# Altium schematic sheet GEN.SchDoc
size A3; SheetNumber: 1; SheetTotal: 3
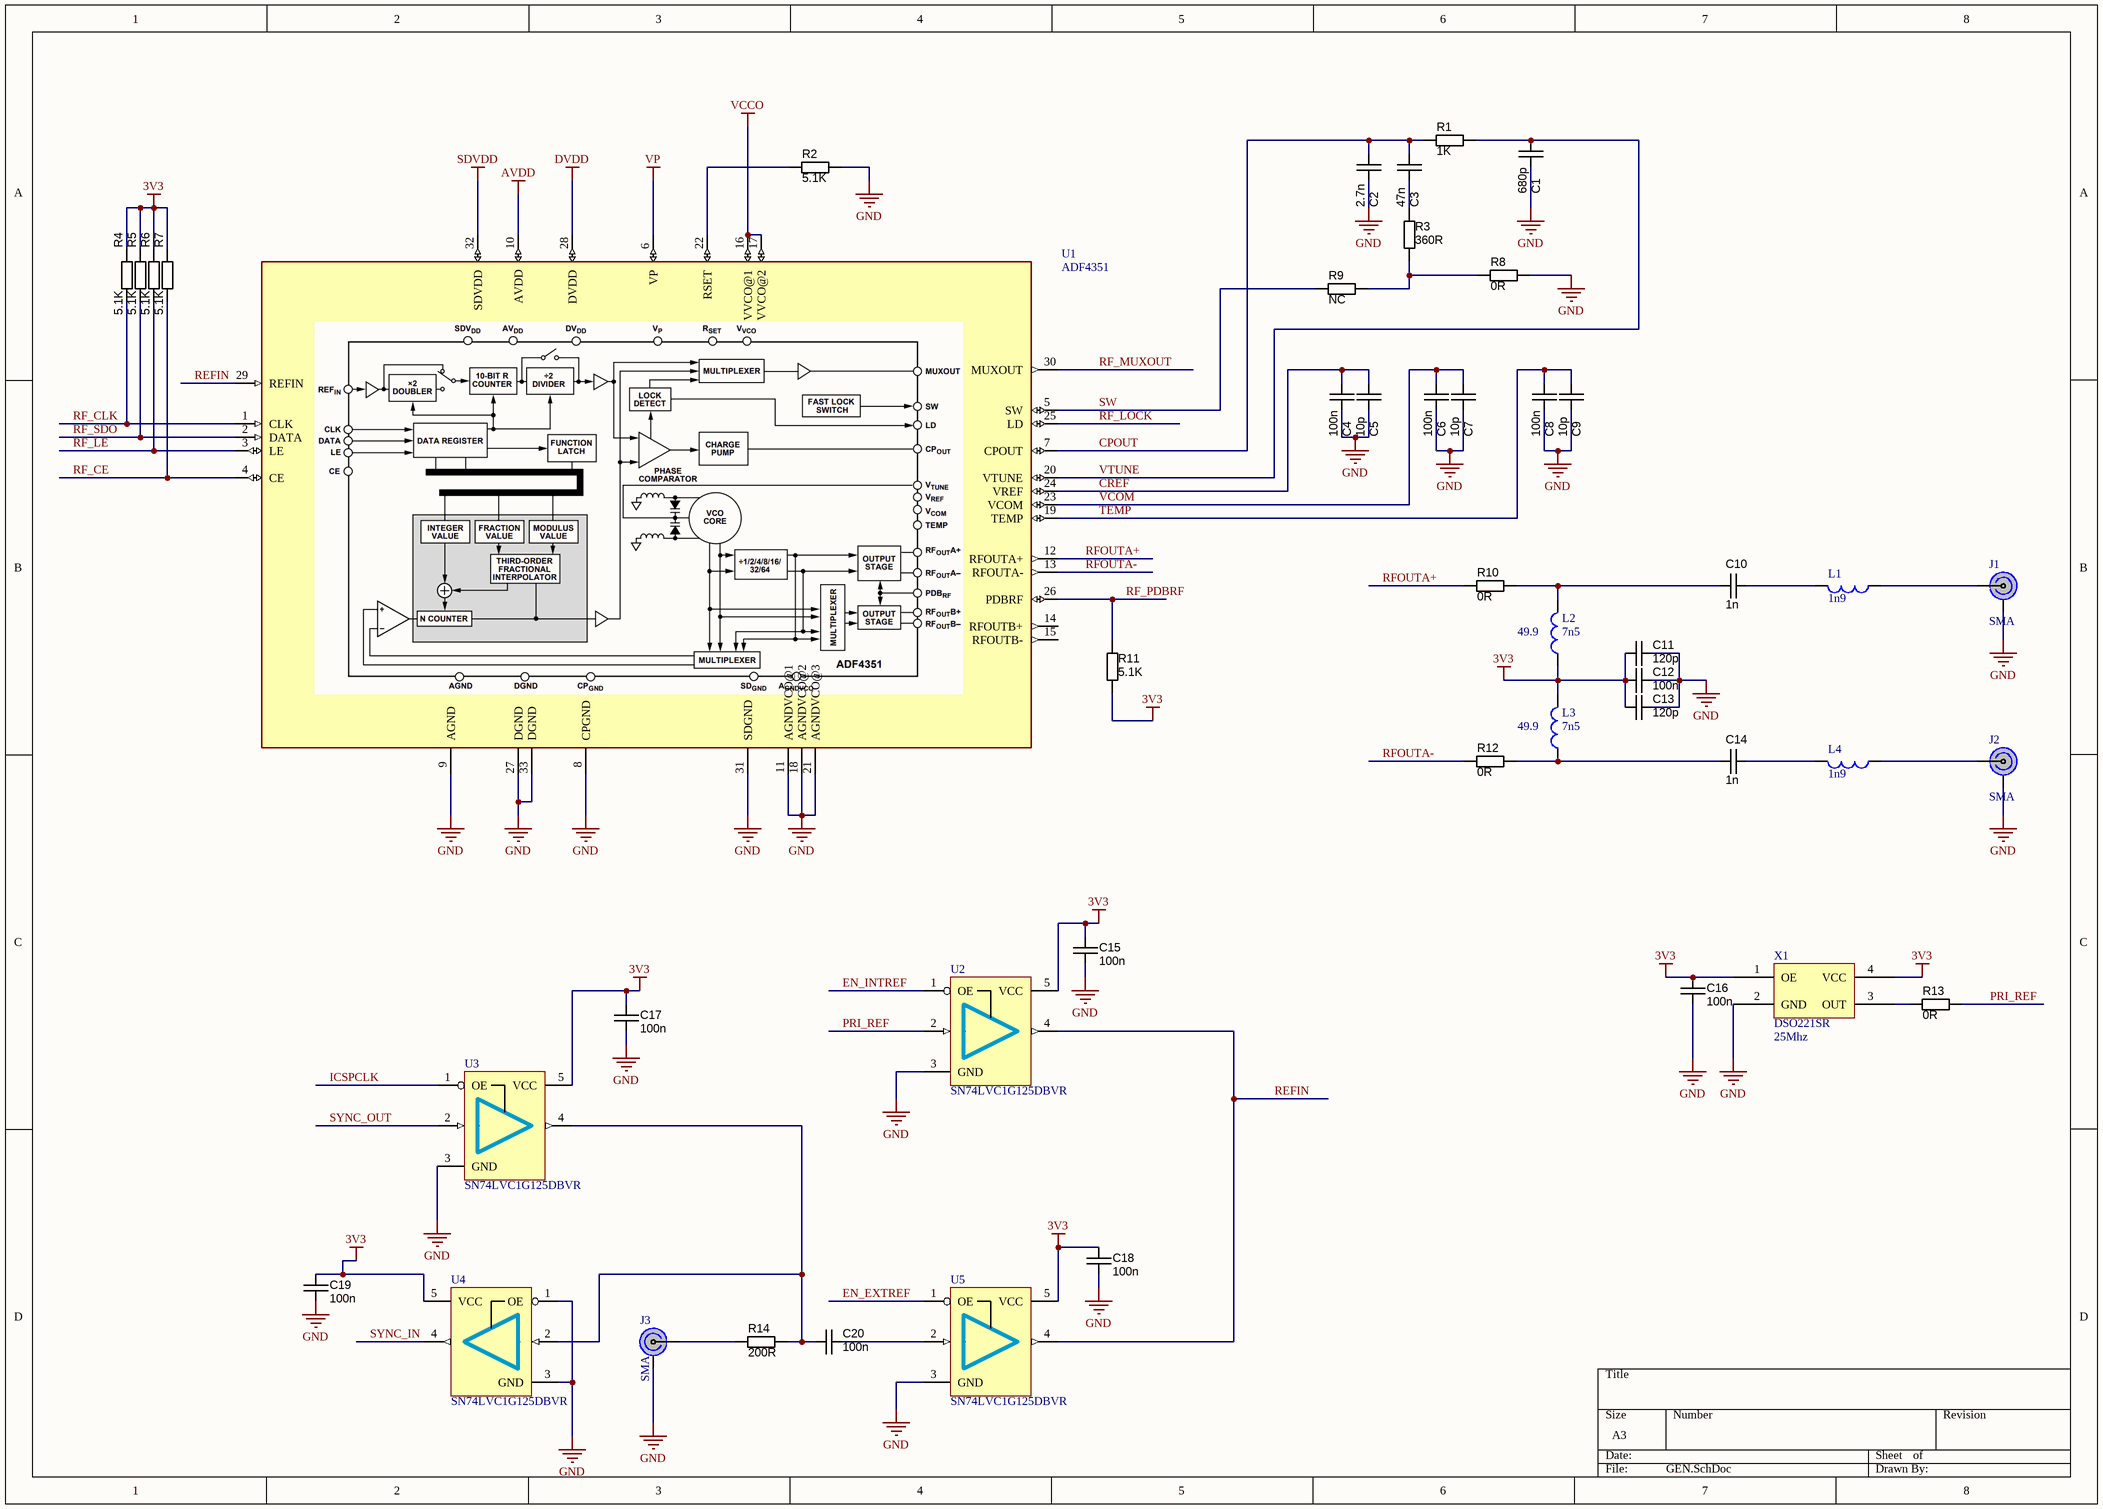
[diagram p0: GEN.SchDoc]

## Parts
C1  680p  [CAPC1005N]
C2  2.7n  [CAPC1005N]
C3  47n  [CAPC1005N]
C4  100n  [CAPC1005N]
C5  10p  [CAPC1005N]
C6  100n  [CAPC1005N]
C7  10p  [CAPC1005N]
C8  100n  [CAPC1005N]
C9  10p  [CAPC1005N]
C10  1n  [CAPC1005N]
C11  120p  [CAPC1005N]
C12  100n  [CAPC1005N]
C13  120p  [CAPC1005N]
C14  1n  [CAPC1005N]
C15  100n  [CAPC1005N]
C16  100n  [CAPC1005N]
C17  100n  [CAPC1005N]
C18  100n  [CAPC1005N]
C19  100n  [CAPC1005N]
C20  100n  [CAPC1005N]
J1  SMA  [BWSMA-KWE-Z001]
J2  SMA  [BWSMA-KWE-Z001]
J3  SMA  [BWSMA-KWE-Z001]
L1  1n9  [0402_Inductor]
L2  7n5  [0402_Inductor]
L3  7n5  [0402_Inductor]
L4  1n9  [0402_Inductor]
R1  value 1K  [RESC1005N]  (hidden comment: Thick Film)
R2  value 5.1K  [RESC1005N]  (hidden comment: Thick Film)
R3  value 360R  [RESC1005N]  (hidden comment: Thick Film)
R4  value 5.1K  [RESC1005N]  (hidden comment: Thick Film)
R5  value 5.1K  [RESC1005N]  (hidden comment: Thick Film)
R6  value 5.1K  [RESC1005N]  (hidden comment: Thick Film)
R7  value 5.1K  [RESC1005N]  (hidden comment: Thick Film)
R8  value 0R  [RESC1005N]  (hidden comment: Thick Film)
R9  value NC  [RESC1005N]  (hidden comment: Thick Film)
R10  value 0R  [RESC1005N]  (hidden comment: Thick Film)
R11  value 5.1K  [RESC1005N]  (hidden comment: Thick Film)
R12  value 0R  [RESC1005N]  (hidden comment: Thick Film)
R13  value 0R  [RESC1005N]  (hidden comment: Thick Film)
R14  value 200R  [RESC1005N]  (hidden comment: Thick Film)
U1  ADF4351  [VQFN32]
U2  SN74LVC1G125DBVR  [SOT23-5]
U3  SN74LVC1G125DBVR  [SOT23-5]
U4  SN74LVC1G125DBVR  [SOT23-5]
U5  SN74LVC1G125DBVR  [SOT23-5]
X1  DSO221SR  value 25Mhz  [Active Oscillator 2520]

## Nets
3V3: C11.2 C12.2 C13.2 C15.2 C16.2 C17.2 C18.2 C19.2 L2.1 L3.2 R4.2 R5.2 R6.2 R7.2 R11.1 U2.5(VCC) U3.5(VCC) U4.5(VCC) U5.5(VCC) X1.1(OE) X1.4(VCC)
AVDD: U1.10(AVDD)
DVDD: U1.28(DVDD)
GND: C1.2 C2.2 C4.2 C5.2 C6.2 C7.2 C8.2 C9.2 C11.1 C12.1 C13.1 C15.1 C16.1 C17.1 C18.1 C19.1 J1.2 J2.2 J3.2 R2.2 R8.1 U1.8(CPGND) U1.9(AGND) U1.11(AGNDVCO@1) U1.18(AGNDVCO@2) U1.21(AGNDVCO@3) U1.27(DGND) U1.31(SDGND) U1.33(DGND) U2.3(GND) U3.3(GND) U4.1(OE) U4.3(GND) U5.3(GND) X1.2(GND)
SDVDD: U1.32(SDVDD)
VCCO: U1.16(VVCO@1) U1.17(VVCO@2)
VP: U1.6(VP)
CPOUT: C2.1 C3.1 R1.1 U1.7(CPOUT)
CREF: C4.1 C5.1 U1.24(VREF)
EN_EXTREF: U5.1(OE)
EN_INTREF: U2.1(OE)
ICSPCLK: U3.1(OE)
PRI_REF: R13.2 U2.2
REFIN: U1.29(REFIN) U2.4 U5.4
RF_CE: R7.1 U1.4(CE)
RF_CLK: R4.1 U1.1(CLK)
RF_LE: R6.1 U1.3(LE)
RF_LOCK: U1.25(LD)
RF_MUXOUT: U1.30(MUXOUT)
RF_PDBRF: R11.2 U1.26(PDBRF)
RF_SDO: R5.1 U1.2(DATA)
RFOUTA+: R10.1 U1.12(RFOUTA+)
RFOUTA-: R12.1 U1.13(RFOUTA-)
SW: R9.2 U1.5(SW)
SYNC_IN: U4.4
SYNC_OUT: U3.2
TEMP: C8.1 C9.1 U1.19(TEMP)
VCOM: C6.1 C7.1 U1.23(VCOM)
VTUNE: C1.1 R1.2 U1.20(VTUNE)
NetC3_2: C3.2 R3.2
NetC10_1: C10.1 L1.2
NetC10_2: C10.2 L2.2 R10.2
NetC14_1: C14.1 L4.2
NetC14_2: C14.2 L3.1 R12.2
NetC20_1: C20.1 U5.2
NetC20_2: C20.2 R14.2 U3.4 U4.2
NetJ1_1: J1.1 L1.1
NetJ2_1: J2.1 L4.1
NetJ3_1: J3.1 R14.1
NetR2_1: R2.1 U1.22(RSET)
NetR3_1: R3.1 R8.2 R9.1
NetR13_1: R13.1 X1.3(OUT)

Not connected (* = marked no-connect by the designer): U1 14(RFOUTB+) 15(RFOUTB-)

## Notes on the sheet
- (near L2) 49.9
- (near L3) 49.9

## Library data of the parts
C1-C20 = CAPC_10n_0402_16V_10%: Capacitor SMD Cer 10nF 10% 16V X7R 0402; Manufacturer 1: AVX Corporation; Manufacturer Part Number 1: 0402YC103KAT2A; Ratings: 16V; X7R; Tolerance: ±10%; Operating Temperature: -55°C ~ 125°C; Package / Case: 0402 (1005 Metric); Size / Dimension: 0.039" L x 0.020" W (1.00mm x 0.50mm); Manufacturer 2: Yageo; Manufacturer Part Number 2: CC0402KRX7R7BB103; Supplier 1: Digi-Key; Supplier Part Number 1: 478-1114-1-ND; ComponentLink1URL: http://www.avx.com/docs/Catalogs/cx7r.pdf; ComponentLink1Description: http://www.avx.com/docs/Catalogs/cx7r.pdf; Supplier 2: Digi-Key; Supplier Part Number 2: 311-1042-1-ND; ComponentLink2URL: http://www.yageo.com/documents/recent/UPY-GPHC_X7R_6.3V-to-50V_8.pdf; ComponentLink2Description: http://www.yageo.com/documents/recent/UPY-GPHC_X7R_6.3V-to-50V_8.pdf
  C1: Value: 680p
  C2: Value: 2.7n
  C3: Value: 47n
  C4 C6 C8 C12 C15-C20: Value: 100n
  C5 C7 C9: Value: 10p
  C10 C14: Value: 1n
  C11 C13: Value: 120p
J1-J3 = SMA Connector
L1-L4 = inductor_smd
R1-R14 = RES_3K3_0402_5%: Resistor SMD chip 3.3k Ohm 0.063W 5% 0402; Manufacturer 1: Yageo; Manufacturer Part Number 1: RC0402JR-073K3L; Ratings: 1/16 W; Package / Case: 0402 (1005 metric); Tolerance: ±5%; Material: Thick Film; Supplier 1: Digi-Key; Supplier Part Number 1: 311-3.3KJRCT-ND; ComponentLink1URL: http://www.yageo.com/documents/recent/PYu-RC0402_51_RoHS_L_6.pdf; ComponentLink1Description: http://www.yageo.com/documents/recent/PYu-RC0402_51_RoHS_L_6.pdf
U1 = ADF4351: Fanout Distribution, Fractional N, Integer N, Clock/Frequency Synthesizer (RF) IC 4.4GHz 1 32-VFQFN Exposed Pad, CSP; MF: Analog Devices, Inc.; Package: None; Price: None; Value: *; SnapEDA_Link: https://www.snapeda.com/parts/ADF4351/Analog+Devices/view-part/?ref=snap; MP: ADF4351; Availability: In Stock; Check_prices: https://www.snapeda.com/parts/ADF4351/Analog+Devices/view-part/?ref=eda
U2-U5 = SN74LVC1G125DBVR: LVC Tristate buffer
X1 = Oscillator_2520: Active Oscillator_2520